# Altium schematic sheet main.SchDoc: main
size A3; SheetNumber: 1; SheetTotal: 11; ENG_APP_DATE: --/--/--; DSN_APP_DATE: --/--/--; CHK_APP_DATE: --/--/--
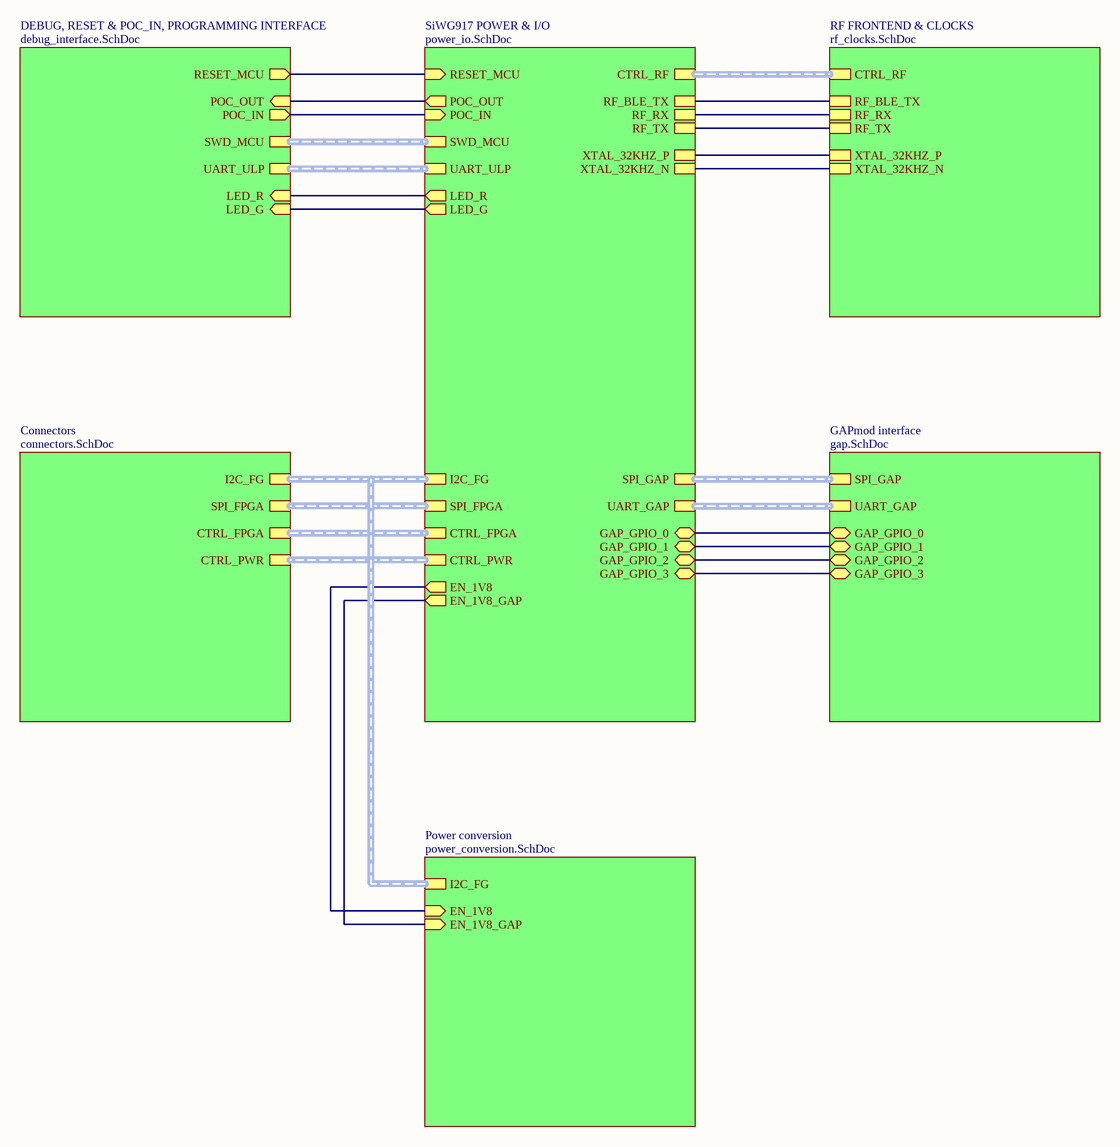
[diagram p0: main.SchDoc]

## Sub-sheets
Connectors = connectors.SchDoc: I2C_FG (harness I2C), SPI_FPGA (harness SPI), CTRL_FPGA (harness FPGA), CTRL_PWR (harness PWR)
DEBUG, RESET & POC_IN, PROGRAMMING INTERFACE = debug_interface.SchDoc: RESET_MCU (out), POC_OUT (in), POC_IN (out), SWD_MCU (harness SWD), UART_ULP (harness UART), LED_R (in), LED_G (in)
GAPmod interface = gap.SchDoc: SPI_GAP (harness SPI), UART_GAP, GAP_GPIO_0 (bidir), GAP_GPIO_1 (bidir), GAP_GPIO_2 (bidir), GAP_GPIO_3 (bidir)
Power conversion = power_conversion.SchDoc: I2C_FG (harness I2C), EN_1V8 (in), EN_1V8_GAP (in)
RF FRONTEND & CLOCKS = rf_clocks.SchDoc: RF_BLE_TX, RF_RX, RF_TX, XTAL_32KHZ_P, XTAL_32KHZ_N, CTRL_RF (harness RF)
SiWG917 POWER & I/O = power_io.SchDoc: RF_BLE_TX, RF_RX, RF_TX, XTAL_32KHZ_P, XTAL_32KHZ_N, RESET_MCU (in), POC_OUT (out), POC_IN (in), I2C_FG (harness I2C), SPI_FPGA (harness SPI), CTRL_FPGA (harness FPGA), CTRL_PWR (harness PWR), CTRL_RF (harness RF), SPI_GAP (harness SPI), GAP_GPIO_0 (bidir), GAP_GPIO_1 (bidir), GAP_GPIO_2 (bidir), UART_ULP (harness UART), SWD_MCU (harness SWD), LED_R (out), LED_G (out), UART_GAP (harness UART), GAP_GPIO_3 (bidir), EN_1V8 (out), EN_1V8_GAP (out)

## Nets
(unnamed): sheet SiWG917 POWER & I/O/RF_BLE_TX, sheet RF FRONTEND & CLOCKS/RF_BLE_TX
(unnamed): sheet SiWG917 POWER & I/O/RF_RX, sheet RF FRONTEND & CLOCKS/RF_RX
(unnamed): sheet SiWG917 POWER & I/O/RF_TX, sheet RF FRONTEND & CLOCKS/RF_TX
(unnamed): sheet SiWG917 POWER & I/O/XTAL_32KHZ_P, sheet RF FRONTEND & CLOCKS/XTAL_32KHZ_P
(unnamed): sheet SiWG917 POWER & I/O/XTAL_32KHZ_N, sheet RF FRONTEND & CLOCKS/XTAL_32KHZ_N
(unnamed): sheet SiWG917 POWER & I/O/RESET_MCU, sheet DEBUG, RESET & POC_IN, PROGRAMMING INTERFACE/RESET_MCU
(unnamed): sheet SiWG917 POWER & I/O/POC_OUT, sheet DEBUG, RESET & POC_IN, PROGRAMMING INTERFACE/POC_OUT
(unnamed): sheet SiWG917 POWER & I/O/POC_IN, sheet DEBUG, RESET & POC_IN, PROGRAMMING INTERFACE/POC_IN
(unnamed): sheet SiWG917 POWER & I/O/GAP_GPIO_0, sheet GAPmod interface/GAP_GPIO_0
(unnamed): sheet SiWG917 POWER & I/O/GAP_GPIO_1, sheet GAPmod interface/GAP_GPIO_1
(unnamed): sheet SiWG917 POWER & I/O/GAP_GPIO_2, sheet GAPmod interface/GAP_GPIO_2
(unnamed): sheet SiWG917 POWER & I/O/LED_R, sheet DEBUG, RESET & POC_IN, PROGRAMMING INTERFACE/LED_R
(unnamed): sheet SiWG917 POWER & I/O/LED_G, sheet DEBUG, RESET & POC_IN, PROGRAMMING INTERFACE/LED_G
(unnamed): sheet SiWG917 POWER & I/O/GAP_GPIO_3, sheet GAPmod interface/GAP_GPIO_3
(unnamed): sheet SiWG917 POWER & I/O/EN_1V8, sheet Power conversion/EN_1V8
(unnamed): sheet SiWG917 POWER & I/O/EN_1V8_GAP, sheet Power conversion/EN_1V8_GAP

## Buses and harness runs
harness sheet Connectors/CTRL_FPGA = sheet SiWG917 POWER & I/O/CTRL_FPGA
harness sheet Connectors/CTRL_PWR = sheet SiWG917 POWER & I/O/CTRL_PWR
harness sheet Connectors/I2C_FG = sheet Power conversion/I2C_FG = sheet SiWG917 POWER & I/O/I2C_FG
harness sheet Connectors/SPI_FPGA = sheet SiWG917 POWER & I/O/SPI_FPGA
harness sheet DEBUG, RESET & POC_IN, PROGRAMMING INTERFACE/SWD_MCU = sheet SiWG917 POWER & I/O/SWD_MCU
harness sheet DEBUG, RESET & POC_IN, PROGRAMMING INTERFACE/UART_ULP = sheet SiWG917 POWER & I/O/UART_ULP
harness sheet GAPmod interface/SPI_GAP = sheet SiWG917 POWER & I/O/SPI_GAP
harness sheet GAPmod interface/UART_GAP = sheet SiWG917 POWER & I/O/UART_GAP
harness sheet RF FRONTEND & CLOCKS/CTRL_RF = sheet SiWG917 POWER & I/O/CTRL_RF

## Notes on the sheet
- Project:
- Laboratory:
- Date:
- File:
- Rev:
- Variation:
- Drawn By:
- Checked By:
- Sheet:
- /